# Altium schematic sheet Nixie Tester.SchDoc
size Letter; SheetNumber: 1; SheetTotal: 1; SPICEModelCacheZZTTJLZS: <root> / <DocumentId>ZZTTJLZS</DocumentId> / </root>
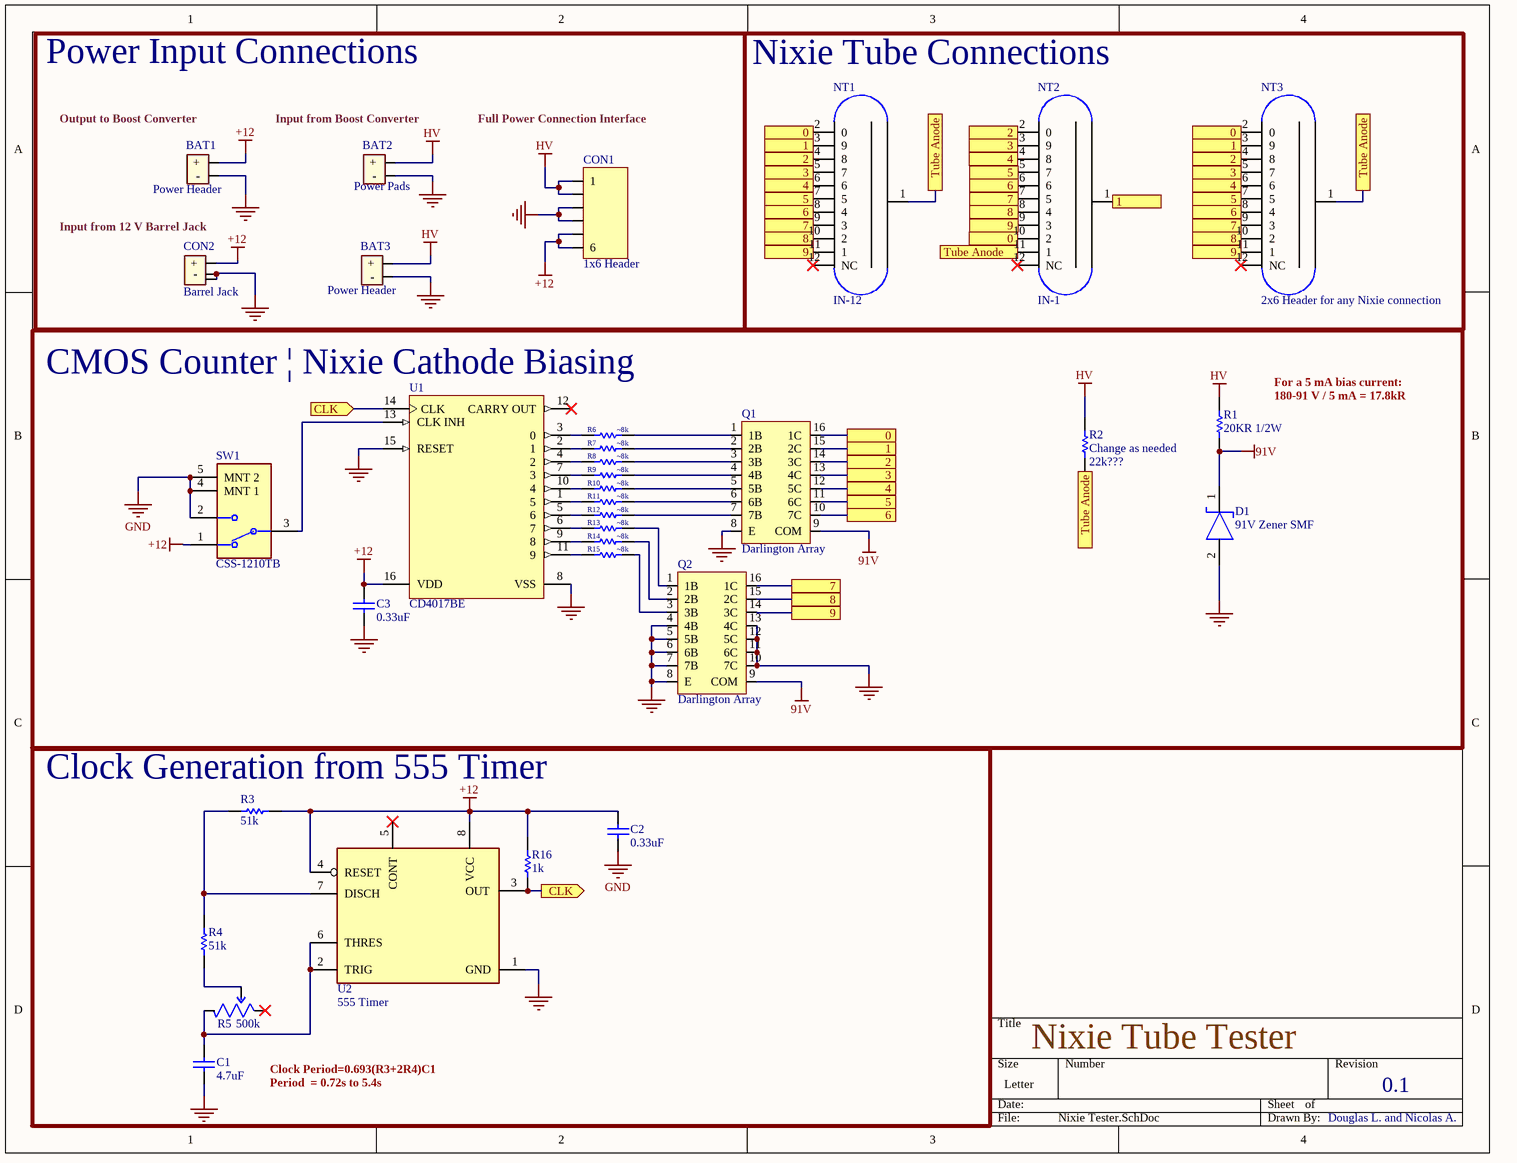
[diagram p0: Nixie Tester.SchDoc]

## Parts
BAT1  Power Header  [TWO PIN HEADER POWER]
BAT2  Power Pads  [Power Pads]
BAT3  Power Header  [TWO PIN HEADER POWER]
C1  4.7uF  [0805]
C2  0.33uF  [0805]
C3  0.33uF  [0805]
CON1  1x6 Header  [1x6 Header]
CON2  Barrel Jack  [Power Barrel Jack]
D1  91V Zener SMF  [SMF - Diode]
NT1  IN-12  [IN-12A Nixie]
NT2  IN-1  [IN-1 NIXIE]
NT3  2x6 Header for any Nixie connection  [2x6 Header]
Q1  Darlington Array  [16-SOIC]
Q2  Darlington Array  [16-SOIC]
R1  20KR 1/2W  [0805]
R2  Change as needed  value 22k???  [AXIAL-0.3]
R3  51k  [0805]
R4  51k  [0805]
R5  500k  [THREE PIN HEADER]
R6  ~8k  [0805]
R7  ~8k  [0805]
R8  ~8k  [0805]
R9  ~8k  [0805]
R10  ~8k  [0805]
R11  ~8k  [0805]
R12  ~8k  [0805]
R13  ~8k  [0805]
R14  ~8k  [0805]
R15  ~8k  [0805]
R16  1k  [0805]
SW1  CSS-1210TB  [FP-CSS-1210TB-MFG]
U1  CD4017BE  [16-SOIC]
U2  555 Timer  [8-SOIC]

## Blocks framed on the sheet
Power Input Connections: BAT1-BAT3 CON1 CON2
Nixie Tube Connections: NT1-NT3
CMOS Counter | Nixie Cathode Biasing: C3 D1 Q1 Q2 R1 R2 R6-R15 SW1 U1
Clock Generation from 555 Timer: C1 C2 R3-R5 R16 U2

## Ports
0 (see Nixie Tester[3A], Nixie Tester[3B]), 0 (see Nixie Tester[3A], Nixie Tester[3B], Nixie Tester[4A]), 0 (see Nixie Tester[3A], Nixie Tester[4A]), 1 (see Nixie Tester[3A], Nixie Tester[3B]), 1 (see Nixie Tester[3A], Nixie Tester[3B], Nixie Tester[4A]), 1 (see Nixie Tester[3A], Nixie Tester[4A]), 2 (see Nixie Tester[3A], Nixie Tester[3B]), 2 (see Nixie Tester[3A], Nixie Tester[3B], Nixie Tester[4A]), 2 (see Nixie Tester[3A], Nixie Tester[4A]), 3 (see Nixie Tester[3A], Nixie Tester[3B]), 3 (see Nixie Tester[3A], Nixie Tester[3B], Nixie Tester[4A]), 3 (see Nixie Tester[3A], Nixie Tester[4A]), 4 (see Nixie Tester[3A], Nixie Tester[3B]), 4 (see Nixie Tester[3A], Nixie Tester[3B], Nixie Tester[4A]), 4 (see Nixie Tester[3A], Nixie Tester[4A]), 5 (see Nixie Tester[3A], Nixie Tester[3B]), 5 (see Nixie Tester[3A], Nixie Tester[3B], Nixie Tester[4A]), 5 (see Nixie Tester[3A], Nixie Tester[4A]), 6 (see Nixie Tester[3A], Nixie Tester[3B]), 6 (see Nixie Tester[3A], Nixie Tester[3B], Nixie Tester[4A]), 6 (see Nixie Tester[3A], Nixie Tester[4A]), 7 (see Nixie Tester[3A], Nixie Tester[3C]), 7 (see Nixie Tester[3A], Nixie Tester[3C], Nixie Tester[4A]), 7 (see Nixie Tester[3A], Nixie Tester[4A]), 8 (see Nixie Tester[3A], Nixie Tester[3C]), 8 (see Nixie Tester[3A], Nixie Tester[3C], Nixie Tester[4A]), 8 (see Nixie Tester[3A], Nixie Tester[4A]), 9 (see Nixie Tester[3A], Nixie Tester[3C]), 9 (see Nixie Tester[3A], Nixie Tester[3C], Nixie Tester[4A]), 9 (see Nixie Tester[3A], Nixie Tester[4A]), CLK (in, see Nixie Tester[2D]), CLK (out, see Nixie Tester[1B]), Tube Anode (see Nixie Tester[3A], Nixie Tester[3B]), Tube Anode (see Nixie Tester[3A], Nixie Tester[3B], Nixie Tester[4A]), Tube Anode (see Nixie Tester[3A], Nixie Tester[4A])

## Nets
91V: D1.1(C) Q1.9(COM) Q2.9(COM) R1.1
+12: BAT1.1(+) C2.1 C3.1 CON1.5 CON1.6 CON2.1(+) R3.1 R16.2 SW1.1 U1.16(VDD) U2.4(RESET) U2.8(VCC)
GND: BAT1.2(-) BAT2.2(-) BAT3.2(-) C1.1 C2.2 C3.2 CON1.3 CON1.4 CON2.2(-) CON2.3 D1.2(A) Q1.8(E) Q2.4(4B) Q2.5(5B) Q2.6(6B) Q2.7(7B) Q2.8(E) Q2.10(7C) Q2.11(6C) Q2.12(5C) Q2.13(4C) SW1.2 SW1.4(MNT_1) SW1.5(MNT_2) U1.8(VSS) U1.15(RESET) U2.1(GND)
HV: BAT2.1(+) BAT3.1(+) CON1.1 CON1.2 R1.2 R2.2
0: NT1.2(0) NT2.10(2) NT3.2(0) Q1.16(1C) ; port 0
1: NT1.3(9) NT2.1 NT3.3(9) Q1.15(2C) ; port 1
2: NT1.4(8) NT2.2(0) NT3.4(8) Q1.14(3C) ; port 2
3: NT1.5(7) NT2.3(9) NT3.5(7) Q1.13(4C) ; port 3
4: NT1.6 NT2.4(8) NT3.6 Q1.12(5C) ; port 4
5: NT1.7(5) NT2.5(7) NT3.7(5) Q1.11(6C) ; port 5
6: NT1.8(4) NT2.6 NT3.8(4) Q1.10(7C) ; port 6
7: NT1.9(3) NT2.7(5) NT3.9(3) Q2.16(1C) ; port 7
8: NT1.10(2) NT2.8(4) NT3.10(2) Q2.15(2C) ; port 8
9: NT1.11(1) NT2.9(3) NT3.11(1) Q2.14(3C) ; port 9
CLK: R16.1 U1.14(CLK) U2.3(OUT) ; port CLK
Tube Anode: NT1.1 NT2.11(1) NT3.1 R2.1 ; port Tube Anode
NetC1_2: C1.2 R5.3(CW) U2.2(TRIG) U2.6(THRES)
NetQ1_1: Q1.1(1B) R6.1
NetQ1_2: Q1.2(2B) R7.1
NetQ1_3: Q1.3(3B) R8.1
NetQ1_4: Q1.4(4B) R9.1
NetQ1_5: Q1.5(5B) R10.1
NetQ1_6: Q1.6(6B) R11.1
NetQ1_7: Q1.7(7B) R12.1
NetQ2_1: Q2.1(1B) R13.1
NetQ2_2: Q2.2(2B) R14.1
NetQ2_3: Q2.3(3B) R15.1
NetR3_2: R3.2 R4.1 U2.7(DISCH)
NetR4_2: R4.2 R5.2(WIPER)
NetR6_2: R6.2 U1.3(0)
NetR7_2: R7.2 U1.2(1)
NetR8_2: R8.2 U1.4(2)
NetR9_2: R9.2 U1.7(3)
NetR10_2: R10.2 U1.10(4)
NetR11_2: R11.2 U1.1(5)
NetR12_2: R12.2 U1.5(6)
NetR13_2: R13.2 U1.6(7)
NetR14_2: R14.2 U1.9(8)
NetR15_2: R15.2 U1.11(9)
NetSW1_3: SW1.3(C) U1.13(CLK_INH)

Not connected (* = marked no-connect by the designer): NT1 12(NC)*; NT2 12(NC)*; NT3 12(NC)*; R5 1(CCW)*; U1 12(CARRY_OUT)*; U2 5(CONT)*

## Notes on the sheet
- (near BAT1) Output to Boost Converter
- (near BAT2) Input from Boost Converter
- Full Power Connection Interface
- Input from 12 V Barrel Jack
- For a 5 mA bias current:
- 180-91 V / 5 mA = 17.8kR
- Clock Period=0.693(R3+2R4)C1
- Period  = 0.72s to 5.4s
- Nixie Tube Tester
- 0.1
- Douglas L. and Nicolas A.

## Library data of the parts
BAT2 = Power Pads: Power Connections with Pads
C1 = Cap 4.7uF: Capacitor 4.7uF 0805 SMD; Published: 8-Jun-2000; LatestRevisionDate: 17-Jul-2002; LatestRevisionNote: Re-released for DXP Platform.; PackageReference: RAD-0.3; Publisher: Altium Limited; PackageDescription: Radial Cap, Thru-Hole; 2 Leads; 0.3 in Pin Spacing; Value: 4.7uF; Supplier 1: Digi-Key
C2 C3 = Cap 0.33uF: Capacitor 0.33uF 0805 SMD; Published: 8-Jun-2000; LatestRevisionDate: 17-Jul-2002; LatestRevisionNote: Re-released for DXP Platform.; PackageReference: RAD-0.3; Publisher: Altium Limited; PackageDescription: Radial Cap, Thru-Hole; 2 Leads; 0.3 in Pin Spacing; Value: 0.33uF; Supplier 1: Digi-Key; Supplier Part Number 1: 1276-1123-1-ND
CON2 = Barrel Jack Con: 48V, 6A, 2mm Dia; Manufacturer: Tensility; Manufacturer Part Number: 54-00166; Supplier 1: Digikey; Supplier: Digikey; Supplier Part Number: 839-54-00166-ND; RoHS: Yes; Category: Connectors; Stock: 35927; Pricing: 1=0.74, 10=0.648, 25=0.5924, 40=0.5575, 80=0.53425, 230=0.48783, 500=0.4646, 1000=0.3833, 2500=0.34845 (USD); Supplier Part Number 1: 839-54-00166-ND
D1 = BZD27C91P-E3-08: Zener Diode 91 V 800 mW Surface Mount DO-219AB (SMF); Element Configuration: Single; Operating Supply Voltage: 15V; Number of Channels: 1; Clamping Voltage-Max: 24.4V; Max Breakdown Voltage: 16.7V; Capacitance: 350pF; Test Current: 1mA; Direction: Unidirectional; ESD Protection: Yes; Leakage Current: 1uA; Max Power Dissipation: 200W; Peak Pulse Current: 8.2A; Peak Pulse Power: 1kW; Number of Pins: 2; Mount: Surface Mount; Depth: 1.9mm; Height: 0.043inch; Package Quantity: 3000; Packaging: Tape and Reel; Radiation Hardening: No; Width: 0.075inch; Reverse Breakdown Voltage: 16.7V; Min Operating Temperature: -55°C; Reverse Standoff Voltage: 15V; Case/Package: DO-219AB; Clamping Voltage: 24.4V; Polarity: Unidirectional; Length: 2.9mm; Working Voltage: 15V; Breakdown Voltage: 16.7V; Max Operating Temperature: 150°C; Lead Free: Lead Free; Number of Elements: 1; Series: SFMxxA; Termination: SMD/SMT
NT1-NT3 = Nixie Tube
Q1 Q2 = SN75468DR: Bipolar (BJT) Transistor Array 7 NPN Darlington 100V 500mA Surface Mount 16-SOIC
R1 = Res 1M: Resistor 1M 1/2W SMD 0805; Value: 100k; Published: 8-Jun-2000; LatestRevisionDate: 17-Jul-2002; LatestRevisionNote: Re-released for DXP Platform.; PackageReference: AXIAL-0.3; Publisher: Altium Limited; PackageDescription: Axial Device, Thru-Hole; 2 Leads; 0.3 in Pin Spacing; Supplier 1: Digi-Key
R2 = Res1: Resistor; Published: 8-Jun-2000; LatestRevisionDate: 17-Jul-2002; LatestRevisionNote: Re-released for DXP Platform.; PackageReference: AXIAL-0.3; Publisher: Altium Limited; PackageDescription: Axial Device, Thru-Hole; 2 Leads; 0.3 in Pin Spacing
R3 R4 = Res 51k: Resistor 51k SMD 0805; Published: 8-Jun-2000; LatestRevisionDate: 17-Jul-2002; LatestRevisionNote: Re-released for DXP Platform.; PackageReference: AXIAL-0.3; Publisher: Altium Limited; PackageDescription: Axial Device, Thru-Hole; 2 Leads; 0.3 in Pin Spacing; Value: 51k; Supplier 1: Digi-Key
R5 = 500k Pot: Supplier 1: Mouser; Supplier 2: Digi-Key
R6-R15 = Res 10k: Resistor 10k SMD 0805; Published: 8-Jun-2000; LatestRevisionDate: 17-Jul-2002; LatestRevisionNote: Re-released for DXP Platform.; PackageReference: AXIAL-0.3; Publisher: Altium Limited; PackageDescription: Axial Device, Thru-Hole; 2 Leads; 0.3 in Pin Spacing; Supplier 1: Digi-Key; Value: 10k; Supplier Part Number 1: RMCF0805JT10K0CT-ND
R16 = Res 1k: Resistor 1k SMD 0805; Value: 5.1k; Published: 8-Jun-2000; LatestRevisionDate: 17-Jul-2002; LatestRevisionNote: Re-released for DXP Platform.; PackageReference: AXIAL-0.3; Publisher: Altium Limited; PackageDescription: Axial Device, Thru-Hole; 2 Leads; 0.3 in Pin Spacing; Supplier 1: Digikey; Supplier Part Number 1: 311-1.00KCRDKR-ND
SW1 = CMP-71745-000010-1: SWITCH SLIDE SPDT 100MA 12V; Actuator Material: Polymer; Switch Travel: 2mm; Number of Positions: 2; Contact Style: Non-Shorting; Operating Force: 357gf; Switch Function: On-On; Electrical Life: 10000Cycles; Number of Poles: 1; Actuator Type: Standard; Termination: Gull Wing; Contact Plating: Gold; Voltage Rating (DC): 12V; RoHS Compliant: Yes; Packaging: Tape and Reel; Max Operating Temperature: 70°C; Throw Configuration: SPDT; Case/Package: SMD/SMT; Contact Current Rating: 100mA; Actuator Length: 2mm; Mount: Surface Mount; Min Operating Temperature: -20°C; Max Voltage Rating (DC): 12V; Series: CSS; Orientation: Right Angle; Contact Material: Copper Alloy; Radiation Hardening: No; Current Rating: 100mA
U1 = CD4017BM96: Counter IC Counter, Decade 1 Element 10 Bit Positive, Negative 16-SOIC; Manufacturer: Texas Instruments; Schmitt Trigger: No; Output Type: CMOS; VCC(Max)(V): 18; tpd @ Nom Voltage(Max)(ns): 270; ICC @ Nom Voltage(Max)(mA): 0.03; Output Drive (IOL/IOH)(Max)(mA): 1.5/-1.5; VCC(Min)(V): 3; F @ Nom Voltage(Max)(Mhz): 8; Rating: Military; Technology Family: CD4000; Bits(#): 10; Inputs: 1; Type: Decade; Operating Temperature Range(C): -55 to 125; Code_JEDEC: MS-001; Function: Counter; PackageReference: N0016A; DatasheetVersion: SCHS027C; Input Type: CMOS; Generic Part Number: CD4017B; Voltage(Nom)(V): 10
U2 = NA555DR: 555 Type, Timer/Oscillator (Single) IC 100kHz 8-SOIC; Number of Timers/Counters: 1; Min Supply Voltage: 4.5V; Quiescent Current: 15mA; Nominal Supply Current: 2mA; Max Supply Voltage: 16V; Low Level Output Current: 200mA; Operating Supply Current: 10mA; High Level Output Current: -200mA; Height: 1.58mm; Max Operating Temperature: 70°C; Case/Package: SOIC; Package Quantity: 2500; RoHS Compliant: Yes; Min Operating Temperature: 0°C; Frequency: 100kHz; Width: 3.91mm; Mount: Surface Mount; Number of Pins: 8; Packaging: Tape and Reel; Supply Current: 2mA; Length: 4.9mm; Series: -; Weight: 0.002561oz; Radiation Hardening: No; Lead Free: Lead Free